# EAGLE design espMDL_MCP3425_2C (EAGLE 7.5.0)
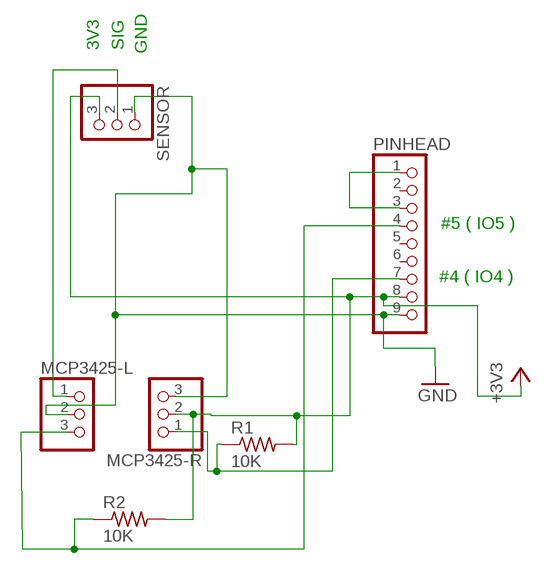
[diagram p0: schematic, sheet 1]

## Parts
MCP3425-L  PINHD-1X3  [1X03]
MCP3425-R  PINHD-1X3  [1X03]
PINHEAD  PINHD-1X9  [1X09]
R1  10K  R-US_0204/7  [0204/7]
R2  10K  R-US_0204/7  [0204/7]
SENSOR  PINHD-1X3  [1X03]

## Nets
+3V3: MCP3425-R.2 PINHEAD.8 R1.2 R2.2 SENSOR.3
GND: MCP3425-L.2 MCP3425-R.3 PINHEAD.9 SENSOR.1
N$2: PINHEAD.1 PINHEAD.3
N$3: MCP3425-R.1 PINHEAD.7 R1.1
N$4: MCP3425-L.1 SENSOR.2
N$7: MCP3425-L.3 PINHEAD.4 R2.1
Unconnected: PINHEAD.2 PINHEAD.5 PINHEAD.6

## Notes on the sheet
- 3V3 | SIG | GND
- #5 ( IO5 )
- #4 ( IO4 )

## Library data of the parts
MCP3425-L MCP3425-R SENSOR = pinhead:PINHD-1X3: PIN HEADER
PINHEAD = pinhead:PINHD-1X9: PIN HEADER
R1 R2 = resistor:R-US_: RESISTOR, American symbol

## Board
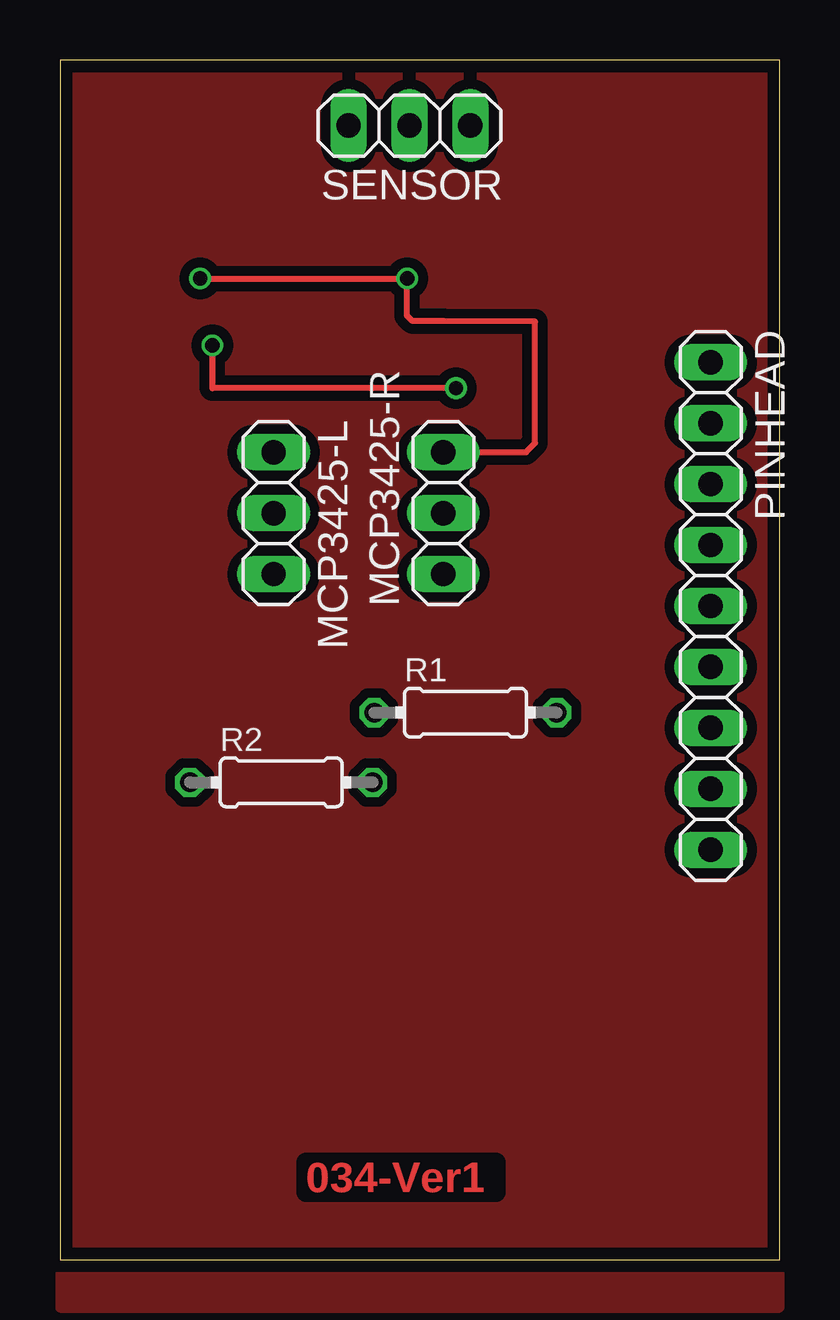
[diagram p1: board, top side]
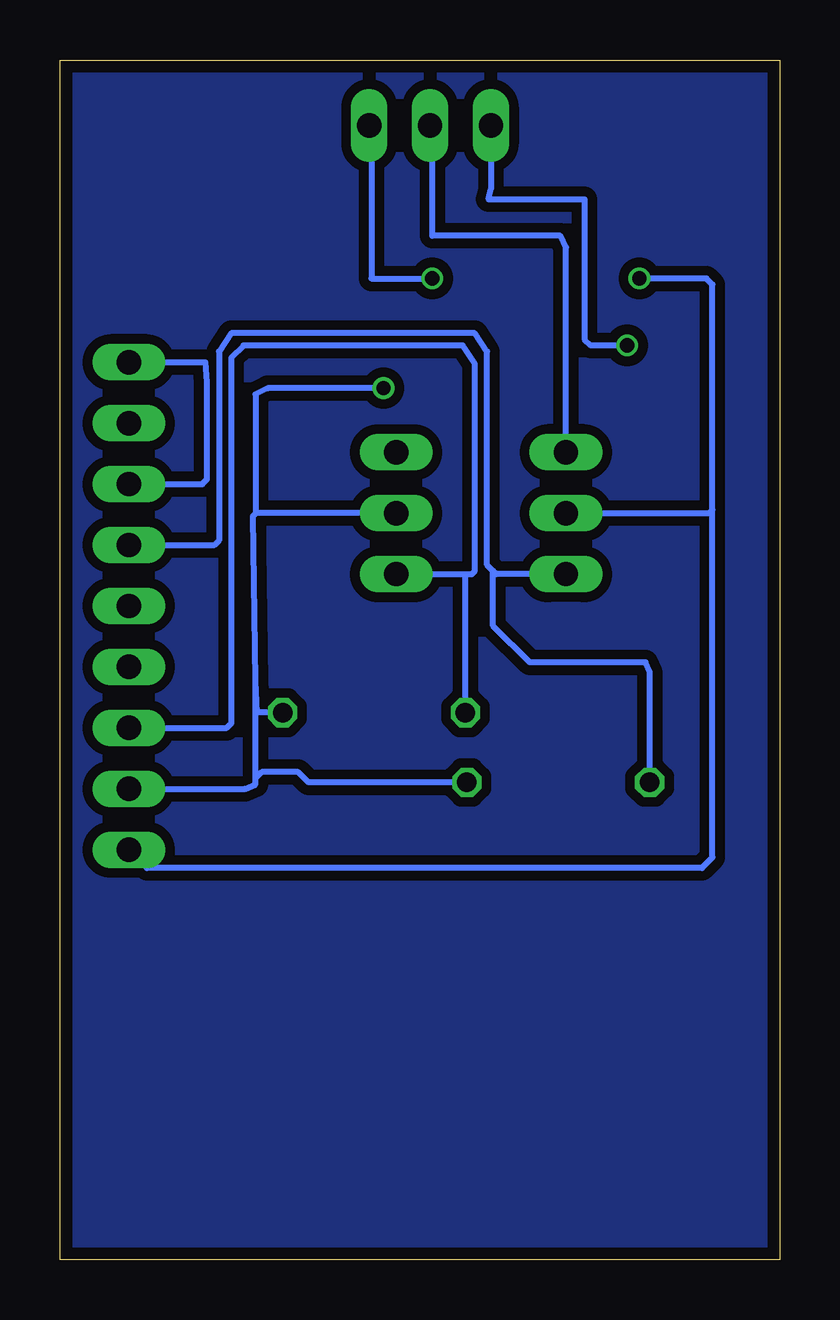
[diagram p2: board, bottom side, seen from below]

Size 30 x 50 mm. Coordinates in mm from the lower left corner, seen from the top.
Outline: 0,0 30,0 30,50 0,50 0,0
Copper layers (1*16): Top 0.035mm / dielectric 1.6mm / Bottom 0.035mm
Design rules "Elecrow_2-layer_PCB_eagle_rule": minimum track width 6mil, minimum drill 12mil, track to track 6mil, track to pad 6mil, pad to pad 6mil, via to via 8mil, smd to smd 0mil, copper to edge 20mil, drill to drill 10mil, minimum pad ring 6mil, minimum via ring 6mil, stop-mask expansion 0mil, vias tented up to drill 100mil, thermal gap 10mil

### Footprints (pad centres in the part's own frame; a part is rotated, then mirrored left to right if it is on the bottom)
1X03 = drill 1.016 long: 1 -2.54,0; 2 0,0; 3 2.54,0
1X09 = drill 1.016 long: 1 -10.16,0; 2 -7.62,0; 3 -5.08,0; 4 -2.54,0; 5 0,0; 6 2.54,0; 7 5.08,0; 8 7.62,0; 9 10.16,0
0204/7 = drill 0.813 octagon: 1 -3.81,0; 2 3.81,0

### Placement (x,y rotation side)
MCP3425-L  8.9,31.11 270 top
MCP3425-R  15.98,31.11 90 top
PINHEAD  27.13,27.24 270 top
R1  16.91,22.8 0 top
R2  9.22,19.89 0 top
SENSOR  14.57,47.27 180 top

### Tracks (layer width: path | path; a pad name or v marks a point on that pad's centre or on a via)
+3V3  (via drill 0.6)
  Top 0.254: v6.35,38.1 6.35,36.32 v16.51,36.32
  Bottom 0.254: PINHEAD.8 22.29,19.62 21.84,19.81 21.84,20.07 | 21.84,20.07 21.84,23.88 21.85,24.12 | 21.85,24.12 21.95,30.99 21.83,31.11 | SENSOR.3 12.03,44.61 12.13,44.2 8.13,44.2 8.13,38.35 7.87,38.1 v6.35,38.1 | R1.2 21.79,22.8 21.85,24.12 | R2.2 19.64,19.89 20.07,20.32 21.59,20.32 21.84,20.07 | MCP3425-R.2 21.83,31.11 | 21.83,31.11 21.84,31.11 21.84,36.07 21.34,36.32 v16.51,36.32
GND  (via drill 0.6)
  Top 0.254: v5.84,40.89 v14.48,40.89 14.46,39.35 14.7,39.12 16,39.12 19.79,39.1 19.81,39.08 19.81,34.04 19.43,33.65 MCP3425-R.3
  Bottom 0.254: 2.79,31.24 2.79,16.76 3.24,16.32 26.37,16.32 PINHEAD.9 | 2.79,31.24 2.79,40.64 3.05,40.89 v5.84,40.89 | SENSOR.1 17.02,47.18 17.02,40.89 v14.48,40.89 | MCP3425-L.2 2.92,31.11 2.79,31.24
N$1
  pour Bottom (isolate 0.406, no thermals): 0,50 0,0 30,0 30,50
N$2
  Bottom 0.254: PINHEAD.1 23.94,37.4 23.88,36.58 23.88,32.51 24.07,32.32 PINHEAD.3
N$3
  Bottom 0.254: MCP3425-R.1 13.21,28.57 | 13.21,28.57 12.83,28.57 12.7,28.7 12.7,37.34 13.21,38.1 22.35,38.1 22.86,37.59 22.86,22.35 23.05,22.16 PINHEAD.7 | R1.1 13.1,28.46 13.21,28.57
N$4
  Bottom 0.254: MCP3425-L.1 8.9,42.18 9.14,42.67 14.48,42.67 14.48,47.18 SENSOR.2
N$6
  pour Top (isolate 0.406, no thermals): 0,50 0,-2 30,-2 30,50
N$7
  Bottom 0.254: MCP3425-L.3 11.81,28.57 11.94,28.7 | R2.1 5.41,24.46 5.59,24.89 10.41,24.89 11.94,26.42 11.94,28.7 | 11.94,28.7 12.19,28.96 12.19,37.85 12.7,38.61 22.86,38.61 23.37,37.85 23.37,29.97 23.56,29.78 PINHEAD.4

### Text on the board
Top: 034-Ver1